# Altium schematic sheet Digital.SchDoc: Myon Deco - Digital Stage
size A; DrawnBy: Matias Lopez; Revision: Prototype; SheetNumber: 4; SheetTotal: 7
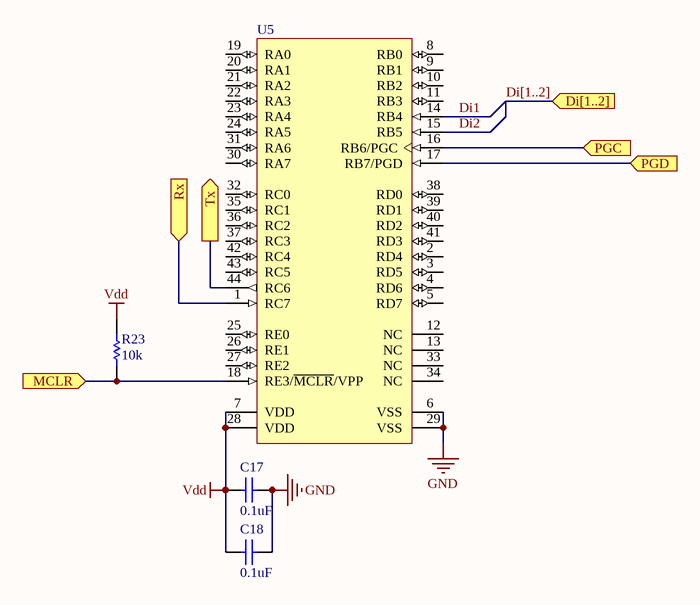
[diagram p0: Digital.SchDoc]

## Parts
C17  value 0.1uF  [C0805]  (hidden comment: Cap)
C18  value 0.1uF  [C0805]  (hidden comment: Cap)
R23  value 10k  [C1206]  (hidden comment: Res1)
U5  MYON  [MCHP-TQFP-PT44_N]  (value not drawn)

## Ports
Di[1..2] (in), MCLR (in), PGC (in), PGD (in), Rx (in), Tx (out)

## Nets
GND: C17.1 C18.1 U5.6(VSS) U5.29(VSS)
Vdd: C17.2 C18.2 R23.1 U5.7(VDD) U5.28(VDD)
Di1: U5.14(RB4)
Di2: U5.15(RB5)
MCLR: R23.2 U5.18(RE3/~{MCLR}/VPP) ; port MCLR
PGC: U5.16(RB6/PGC) ; port PGC
PGD: U5.17(RB7/PGD) ; port PGD
Rx: U5.1(RC7) ; port Rx
Tx: U5.44(RC6) ; port Tx

Not connected (* = marked no-connect by the designer): U5 2(RD4) 3(RD5) 4(RD6) 5(RD7) 8(RB0) 9(RB1) 10(RB2) 11(RB3) 12(NC) 13(NC) 19(RA0) 20(RA1) 21(RA2) 22(RA3) 23(RA4) 24(RA5) 25(RE0) 26(RE1) 27(RE2) 30(RA7) 31(RA6) 32(RC0) 33(NC) 34(NC) 35(RC1) 36(RC2) 37(RC3) 38(RD0) 39(RD1) 40(RD2) 41(RD3) 42(RC4) 43(RC5)

## Buses and harness runs
bus Di[1..2] = port Di[1..2]

## Library data of the parts
C17 C18 = Cap: Capacitor; Published: 8-Jun-2000; LatestRevisionDate: 17-Jul-2002; LatestRevisionNote: Re-released for DXP Platform.; PackageReference: RAD-0.3; Publisher: Altium Limited; PackageDescription: Radial Cap, Thru-Hole; 2 Leads; 0.3 in Pin Spacing
R23 = Res1: Resistor; Published: 8-Jun-2000; LatestRevisionDate: 17-Jul-2002; LatestRevisionNote: Re-released for DXP Platform.; PackageReference: AXIAL-0.3; Publisher: Altium Limited; PackageDescription: Axial Device, Thru-Hole; 2 Leads; 0.3 in Pin Spacing
U5 = PIC18F46K22-I/PT: Low-Power, High-Performance Microcontroller with XLP Technology, 64 MHz, 35 I/O, -40 to 85 degC, 44-pin TQFP (PT44), Tray; Manufacturer: Microchip; # of A/D Channels: 28; Digital Communication: 2 -A/E/USART, 2 -MSSP(SPI/I2C); EEPROM Data Memory (bytes): 1024; I/O Pins: 35; Internal Oscillator: 16 MHz, 31 kHz; Max. CPU Speed MHz: 64; Memory Type: Flash; Operation Voltage Range: 2.3V - 5.5V; Program Memory KWords: 32; RAM: 3896; Timers: 3 - 8-bit, 4 - 16-bit; DatasheetVersion: Rev. F; PackageVersion: C04-076B, 12/2012; PackageReference: TQFP-PT44; PackageDescription: 44-Lead Plastic Thin Quad Flatpack, 10 x 10 mm Body, 0.8 mm Pitch; Supplier 1: Digi-Key; Supplier Part Number 1: PIC18F46K22-I/PT-ND; Supplier 2: Farnell; Supplier Part Number 2: 1814980; Supplier 3: Farnell; Supplier Part Number 3: 1814980MPKG; Supplier 4: Newark; Supplier Part Number 4: 65R6013; Supplier 5: Mouser; Supplier Part Number 5: 579-PIC18F46K22IPT; Packing: TRAY; Program Memory KBytes: 64; RoHS: TRUE; Mounting Technology: Surface Mount; PartNumber: PIC18F46K22-I/PT; ComponentLink1Description: Datasheet; ComponentLink1URL: http://ww1.microchip.com/downloads/en/DeviceDoc/41412F.pdf; ComponentLink2Description: Package Specification; ComponentLink2URL: http://www.microchip.com/stellent/groups/techpub_sg/documents/packagingspec/en012702.pdf; ComponentLink3Description: URL Link1; ComponentLink3URL: Product URL:http://www.microchip.com/datasheet/PIC18F46K22